# EAGLE design Integrated Adapter (EAGLE 9.6.2)
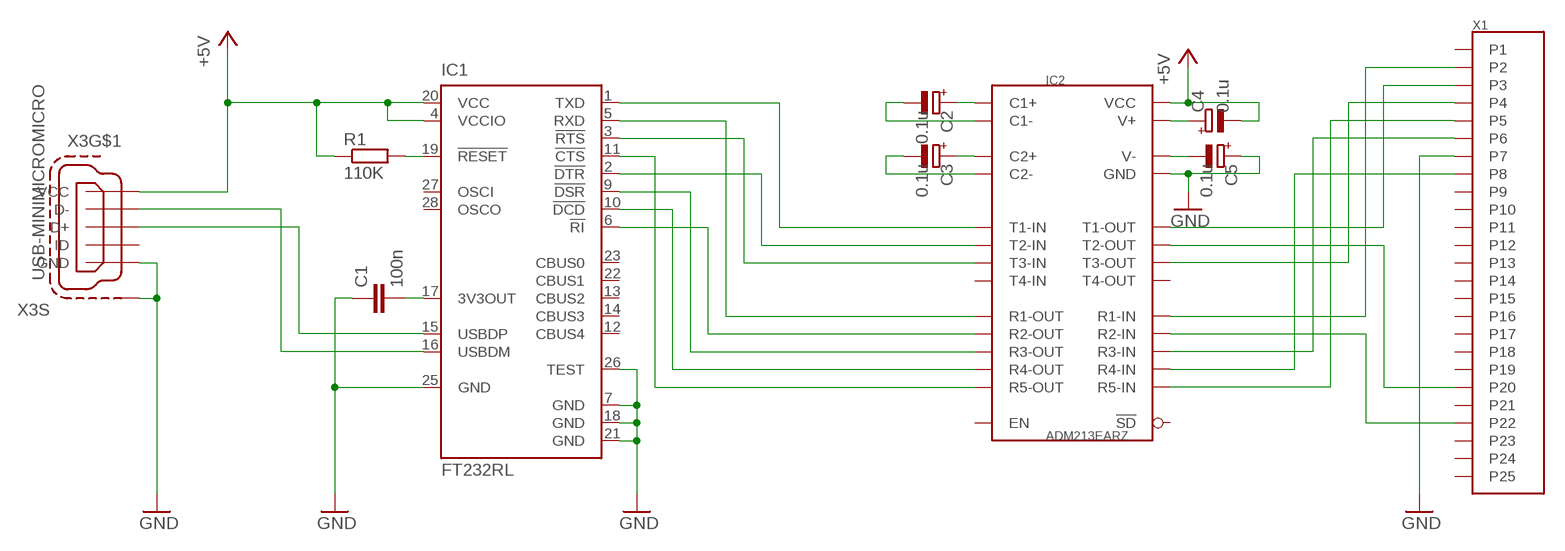
[diagram p0: schematic, sheet 1]

## Parts
C1  100n  CAP_0805  [CAP0805]
C2  0.1u  CAP-POL_CAPE3216-A  [CAPMP3317X180]
C3  0.1u  CAP-POL_CAPE3216-A  [CAPMP3317X180]
C4  0.1u  CAP-POL_CAPE3216-A  [CAPMP3317X180]
C5  0.1u  CAP-POL_CAPE3216-A  [CAPMP3317X180]
IC1  FT232RL  [SSOP28]
IC2  ADM213EARZ  [SO28L]
R1  110K  R_R0805  [RESC2012X50]
X1  DP-25  [DB-25F_SMD]
X3  USB-MINIMICROMICRO  [USB-B-MICRO-SMD]

## Nets
+5V: C4.2(-) IC1.4(VCCIO) IC1.20(VCC) IC2.11(VCC) R1.1 X3.VBUS(VCC)
C1+: C2.1(+) IC2.12(C1+)
C1-: C2.2(-) IC2.14(C1-)
C2+: C3.1(+) IC2.15(C2+)
C2-: C3.2(-) IC2.16(C2-)
GND: C1.1 C5.1(+) IC1.7(GND) IC1.18(GND) IC1.21(GND) IC1.25(GND) IC1.26(TEST) IC2.10(GND) X1.P7 X3.GND X3.SHIELD1(S:S1) X3.SHIELD2(S:S1) X3.SHIELD3(S:S1)
N$3: C1.2 IC1.17(3V3OUT)
N$4: IC1.19(!RESET) R1.2
N$5: IC1.1(TXD) IC2.7(T1-IN)
N$6: IC1.2(!DTR) IC2.6(T2-IN)
N$7: IC1.3(!RTS) IC2.20(T3-IN)
N$8: IC1.5(RXD) IC2.8(R1-OUT)
N$9: IC1.6(!RI) IC2.5(R2-OUT)
N$10: IC1.9(!DSR) IC2.26(R3-OUT)
N$11: IC1.10(!DCD) IC2.22(R4-OUT)
N$12: IC1.11(!CTS) IC2.19(R5-OUT)
N$13: IC2.2(T1-OUT) X1.P3
N$14: IC2.9(R1-IN) X1.P2
N$15: IC2.1(T3-OUT) X1.P4
N$16: IC2.18(R5-IN) X1.P5
N$17: IC2.27(R3-IN) X1.P6
N$18: IC2.3(T2-OUT) X1.P20
N$19: IC2.4(R2-IN) X1.P22
N$20: IC2.23(R4-IN) X1.P8
USB_N [USB-data]: IC1.16(USBDM) X3.D-
USB_P [USB-data]: IC1.15(USBDP) X3.D+
V+: C4.1(+) IC2.13(V+)
V-: C5.2(-) IC2.17(V-)
Unconnected: IC1.12(CBUS4) IC1.13(CBUS2) IC1.14(CBUS3) IC1.22(CBUS1) IC1.23(CBUS0) IC1.27(OSCI) IC1.28(OSCO) IC2.21(T4-IN) IC2.24(EN) IC2.25(!SD) IC2.28(T4-OUT) X1.P1 X1.P9 X1.P10 X1.P11 X1.P12 X1.P13 X1.P14 X1.P15 X1.P16 X1.P17 X1.P18 X1.P19 X1.P21 X1.P23 X1.P24 X1.P25 X3.ID

## Library data of the parts
C1 = Flamberm:CAP_
C2-C5 = Flamberm:CAP-POL_
IC1 = ftdichip:FT232R: Source: http://www.ftdichip.com/Documents/DataSheets/DS_FT232R_v104.pdf; MPN: FT232RL; OC_FARNELL: 1146032; OC_NEWARK: 91K9918
IC2 = Flamberm:ADM213
R1 = Flamberm:R_
X1 = Flamberm:DP-25
X3 = Flamberm:USB-MINIMICRO: MINI USB-B Conector Source: www.cypressindustries.com

## Net classes
0 default: width 0.305 mm, drill 0.3 mm, clearance 0.254 mm
1 USB-data: width 0.305 mm, drill 0.3 mm, clearance 0.254 mm

## Board
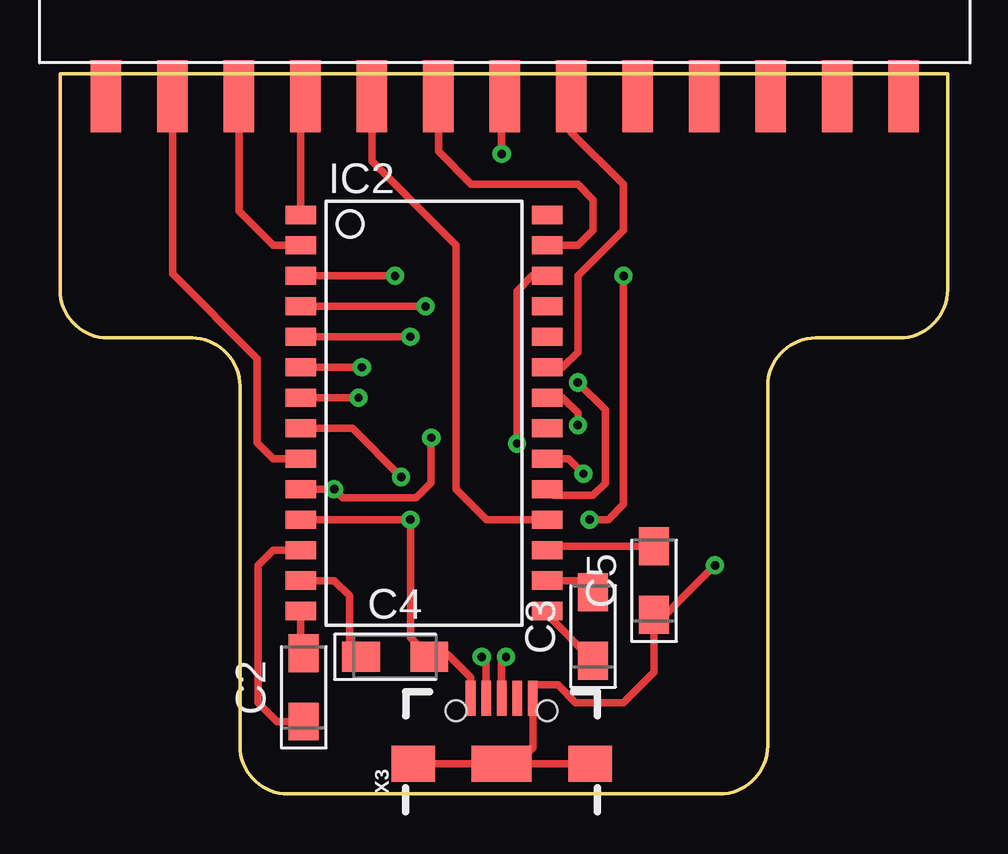
[diagram p1: board, top side]
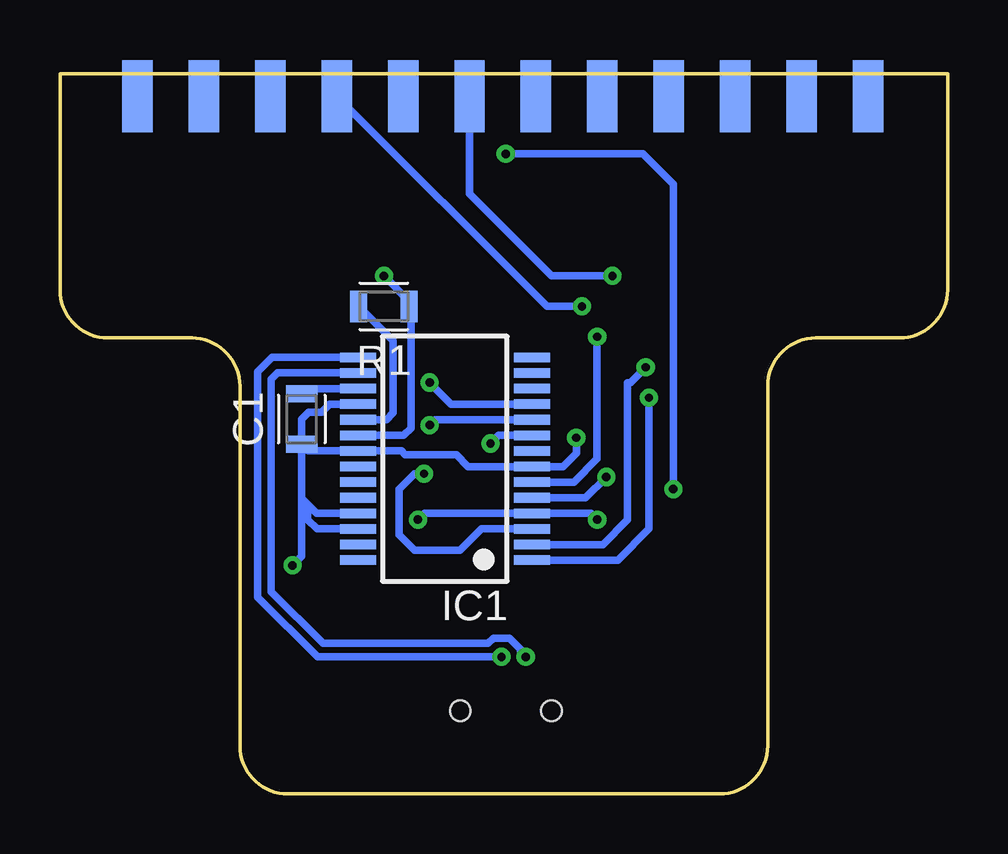
[diagram p2: board, bottom side, seen from below]

Size 37 x 30 mm. Coordinates in mm from the lower left corner, seen from the top.
Outline: 31.5,19 35,19 arc90 37,21 37,30 0,30 0,21 arc90 2,19 5.5,19 arc-90 7.5,17 7.5,2 arc90 9.5,0 27.5,0 arc90 29.5,2 29.5,17 arc-90 31.5,19
Copper layers (1*16): Top 0.035mm / dielectric 1.5mm / Bottom 0.035mm
Design rules "EagleDesignRules": minimum track width 0.25mm, minimum drill 0.3mm, track to track 0.25mm, track to pad 0.25mm, pad to pad 0.25mm, via to via 0.25mm, smd to smd 0.25mm, copper to edge 0.5mm, drill to drill 0.5mm, minimum pad ring 10mil, minimum via ring 8mil, stop-mask expansion 4mil, vias tented up to drill 0mil, thermal gap 0.25mm

### Footprints (pad centres in the part's own frame; a part is rotated, then mirrored left to right if it is on the bottom)
CAP0805 = smd 0.712 x 1.312: 1 -1.05,0; 2 1.05,0
CAPMP3317X180 = smd 1.579 x 1.25: 1 -1.425,0; 2 1.425,0
SSOP28 = smd 0.4 x 1.5: 1 -4.225,-3.625; 2 -3.575,-3.625; 3 -2.925,-3.625; 4 -2.275,-3.625; 5 -1.625,-3.625; 6 -0.975,-3.625; 7 -0.325,-3.625; 8 0.325,-3.625; 9 0.975,-3.625; 10 1.625,-3.625; 11 2.275,-3.625; 12 2.925,-3.625; 13 3.575,-3.625; 14 4.225,-3.625; 15 4.225,3.625; 16 3.575,3.625; 17 2.925,3.625; 18 2.275,3.625; 19 1.625,3.625; 20 0.975,3.625; 21 0.325,3.625; 22 -0.325,3.625; 23 -0.975,3.625; 24 -1.625,3.625; 25 -2.275,3.625; 26 -2.925,3.625; 27 -3.575,3.625; 28 -4.225,3.625
SO28L = smd 0.762 x 1.27: 1 -7.62,-5.207; 2 -6.35,-5.207; 3 -5.08,-5.207; 4 -3.81,-5.207; 5 -2.54,-5.207; 6 -1.27,-5.207; 7 0,-5.207; 8 1.27,-5.207; 9 2.54,-5.207; 10 3.81,-5.207; 11 5.08,-5.207; 12 6.35,-5.207; 13 7.62,-5.207; 14 8.89,-5.207; 15 8.89,5.08; 16 7.62,5.08; 17 6.35,5.08; 18 5.08,5.08; 19 3.81,5.08; 20 2.54,5.08; 21 1.27,5.08; 22 0,5.08; 23 -1.27,5.08; 24 -2.54,5.08; 25 -3.81,5.08; 26 -5.08,5.08; 27 -6.35,5.08; 28 -7.62,5.08
RESC2012X50 = smd 0.712 x 1.312: 1 -1.05,0; 2 1.05,0
DB-25F_SMD = smd 1.27 x 3: P1 -16.62,0; P2 -13.85,0; P3 -11.08,0; P4 -8.31,0; P5 -5.54,0; P6 -2.77,0; P7 0,0; P8 2.77,0; P9 5.54,0; P10 8.31,0; P11 11.08,0; P12 13.85,0; P13 16.62,0 | smd 1.27 x 3 bottom: P14 -15.235,0; P15 -12.465,0; P16 -9.695,0; P17 -6.925,0; P18 -4.155,0; P19 -1.385,0; P20 1.385,0; P21 4.155,0; P22 6.925,0; P23 9.695,0; P24 12.465,0; P25 15.235,0
USB-B-MICRO-SMD = smd 1.45 x 0.4: D+ 2.725,0; D- 2.725,0.65; GND 2.725,-1.3; ID 2.725,-0.65; VBUS 2.725,1.3 | smd 1.5 x 1.8: SHIELD1 0,3.685; SHIELD2 0,-3.685 | smd 1.5 x 2.5: SHIELD3 0,0 | hole 0.85: 2.2,1.9; 2.2,-1.9

### Placement (x,y rotation side)
C1  26.92,15.62 90 bottom
C2  10.16,4.45 90 top
C3  22.23,6.99 90 top
C4  13.97,5.71 0 top
C5  24.77,8.89 90 top
IC1  20.95,13.97 90 bottom
IC2  15.24,16.51 270 top
R1  23.5,20.32 180 bottom
X1  18.54,29.08 0 top
X3  18.41,1.27 90 top

### Tracks (layer width: path | path; a pad name or v marks a point on that pad's centre or on a via)
+5V  (via drill 0.35)
  Top 0.305: IC2.11 v14.61,11.43 14.61,6.5 15.32,5.79 | C4.2 15.32,5.79 | X3.VBUS 17.11,4.86 16.18,5.79 15.32,5.79 | v23.5,21.59 23.5,12.06 22.86,11.43 v22.07,11.43
  Bottom 0.305: v14.61,11.43 14.87,11.7 IC1.4 21.81,11.7 v22.07,11.43 | IC1.20 22.67,14.95 22.38,15.24 22.38,20.25 R1.1 22.45,20.54 v23.5,21.59
C1+
  Top 0.305: IC2.12 8.89,10.16 8.26,9.53 8.26,3.81 9.04,3.02 C2.1
C1-
  Top 0.305: C2.2 10.03,6 IC2.14
C2+
  Top 0.305: C3.1 20.32,7.46 IC2.15
C2-
  Top 0.305: C3.2 21.75,8.89 IC2.16
GND  (via drill 0.35)
  Top 0.305: X3.SHIELD1 X3.SHIELD3 19.05,1.27 | 19.05,1.27 X3.SHIELD2 | 19.05,1.27 19.71,1.94 X3.GND 19.71,4.39 19.87,4.55 20.76,4.55 21.5,3.81 23.5,3.81 24.77,5.08 C5.1 25.25,7.46 v27.3,9.53 | IC2.10 v11.43,12.7 11.79,12.34 14.85,12.34 15.48,12.97 v15.48,14.84 | v18.41,26.67 18.41,28.96 X1.P7
  Bottom 0.305: C1.1 26.65,14.29 IC1.21 22.77,14.29 22.61,14.13 20.48,14.13 20,13.64 IC1.7 16.04,13.64 15.48,14.21 v15.48,14.84 | IC1.25 26.3,11.7 26.67,12.06 | 26.67,12.06 26.92,12.32 | 26.92,12.32 C1.1 | IC1.26 26.29,11.04 26.67,11.43 | 26.67,12.06 26.67,11.43 | v11.43,12.7 11.43,25.4 12.7,26.67 v18.41,26.67 | IC1.18 25.76,16.25 26.08,15.92 26.09,15.92 26.1,15.91 26.64,15.91 26.92,15.62 C1.1 | v27.3,9.53 26.92,9.91 26.92,11.68 | 26.67,11.43 26.92,11.68 | 26.92,11.68 26.92,12.32
N$3
  Bottom 0.305: IC1.17 26.92,16.89 C1.2
N$4
  Bottom 0.305: IC1.19 23.39,15.6 23.11,15.88 23.11,18.89 R1.2
N$5  (via drill 0.35)
  Top 0.305: IC2.7 v12.45,16.51
  Bottom 0.305: v12.45,16.51 12.45,11.05 13.75,9.74 IC1.1
N$6  (via drill 0.35)
  Top 0.305: IC2.6 v12.58,17.78
  Bottom 0.305: v12.58,17.78 13.22,17.14 13.34,17.14 13.34,11.42 14.37,10.39 IC1.2
N$7  (via drill 0.35)
  Top 0.305: v21.82,13.34 21.2,13.97 IC2.20
  Bottom 0.305: v21.82,13.34 22.22,13.34 22.86,12.7 22.86,10.79 22.23,10.16 20.32,10.16 19.43,11.04 IC1.3
N$8  (via drill 0.35)
  Top 0.305: v14.22,13.21 12.19,15.24 IC2.8
  Bottom 0.305: IC1.5 15.09,12.35 v14.22,13.21
N$9  (via drill 0.35)
  Top 0.305: IC2.5 v14.61,19.05
  Bottom 0.305: v14.61,19.05 14.61,13.97 15.58,12.99 IC1.6
N$10  (via drill 0.35)
  Top 0.305: v19.05,14.61 19.05,20.95 19.68,21.59 IC2.26
  Bottom 0.305: IC1.9 18.71,14.95 v19.05,14.61
N$11  (via drill 0.35)
  Top 0.305: v21.59,15.37 21.59,15.88 20.95,16.51 IC2.22
  Bottom 0.305: IC1.10 21.36,15.6 v21.59,15.37
N$12  (via drill 0.35)
  Top 0.305: v21.59,17.14 22.73,16 22.73,12.95 22.23,12.45 20.57,12.45 IC2.19
  Bottom 0.305: IC1.11 20.69,16.25 v21.59,17.14
N$13
  Top 0.305: X1.P3 7.46,24.29 8.89,22.86 IC2.2
N$14
  Top 0.305: IC2.9 8.89,13.97 8.23,14.63 8.23,18.14 4.69,21.68 X1.P2
N$15
  Top 0.305: IC2.1 10.03,28.88 X1.P4
N$16
  Top 0.305: X1.P5 13,26.37 16.51,22.86 16.51,15.88 16.51,12.7 17.14,12.06 17.46,11.75 17.78,11.43 IC2.18
N$17
  Top 0.305: IC2.27 21.59,22.86 22.23,23.5 22.23,24.77 21.59,25.4 17.14,25.4 15.77,26.77 X1.P6
N$18  (via drill 0.35)
  Top 0.305: v13.97,21.59 IC2.3
  Bottom 0.305: X1.P20 19.93,25.01 16.51,21.59 v13.97,21.59
N$19  (via drill 0.35)
  Top 0.305: v15.24,20.32 IC2.4
  Bottom 0.305: X1.P22 16.7,20.32 v15.24,20.32
N$20
  Top 0.305: X1.P8 21.31,27.58 23.5,25.4 23.5,23.5 21.59,21.59 21.59,18.41 20.95,17.78 IC2.23
USB_N  (via drill 0.35)
  Top 0.305: v17.59,5.71 17.77,5.54 X3.D-
  Bottom 0.305: v17.59,5.71 17.81,5.94 17.81,6.04 18.27,6.5 18.92,6.5 19.15,6.27 26.04,6.27 28.19,8.43 28.19,17.27 27.92,17.55 IC1.16
USB_P  (via drill 0.35)
  Top 0.305: v18.59,5.71 18.41,5.54 X3.D+
  Bottom 0.305: v18.59,5.71 26.27,5.71 28.75,8.2 28.75,17.6 28.16,18.2 IC1.15
V+
  Top 0.305: IC2.13 11.43,8.89 12.06,8.26 12.06,6.2 C4.1
V-
  Top 0.305: IC2.17 20.48,10.31 C5.2